# Altium schematic sheet TapDriver-ESP32.schdoc_2022-04-13.schdoc
size 401 x 180 mm
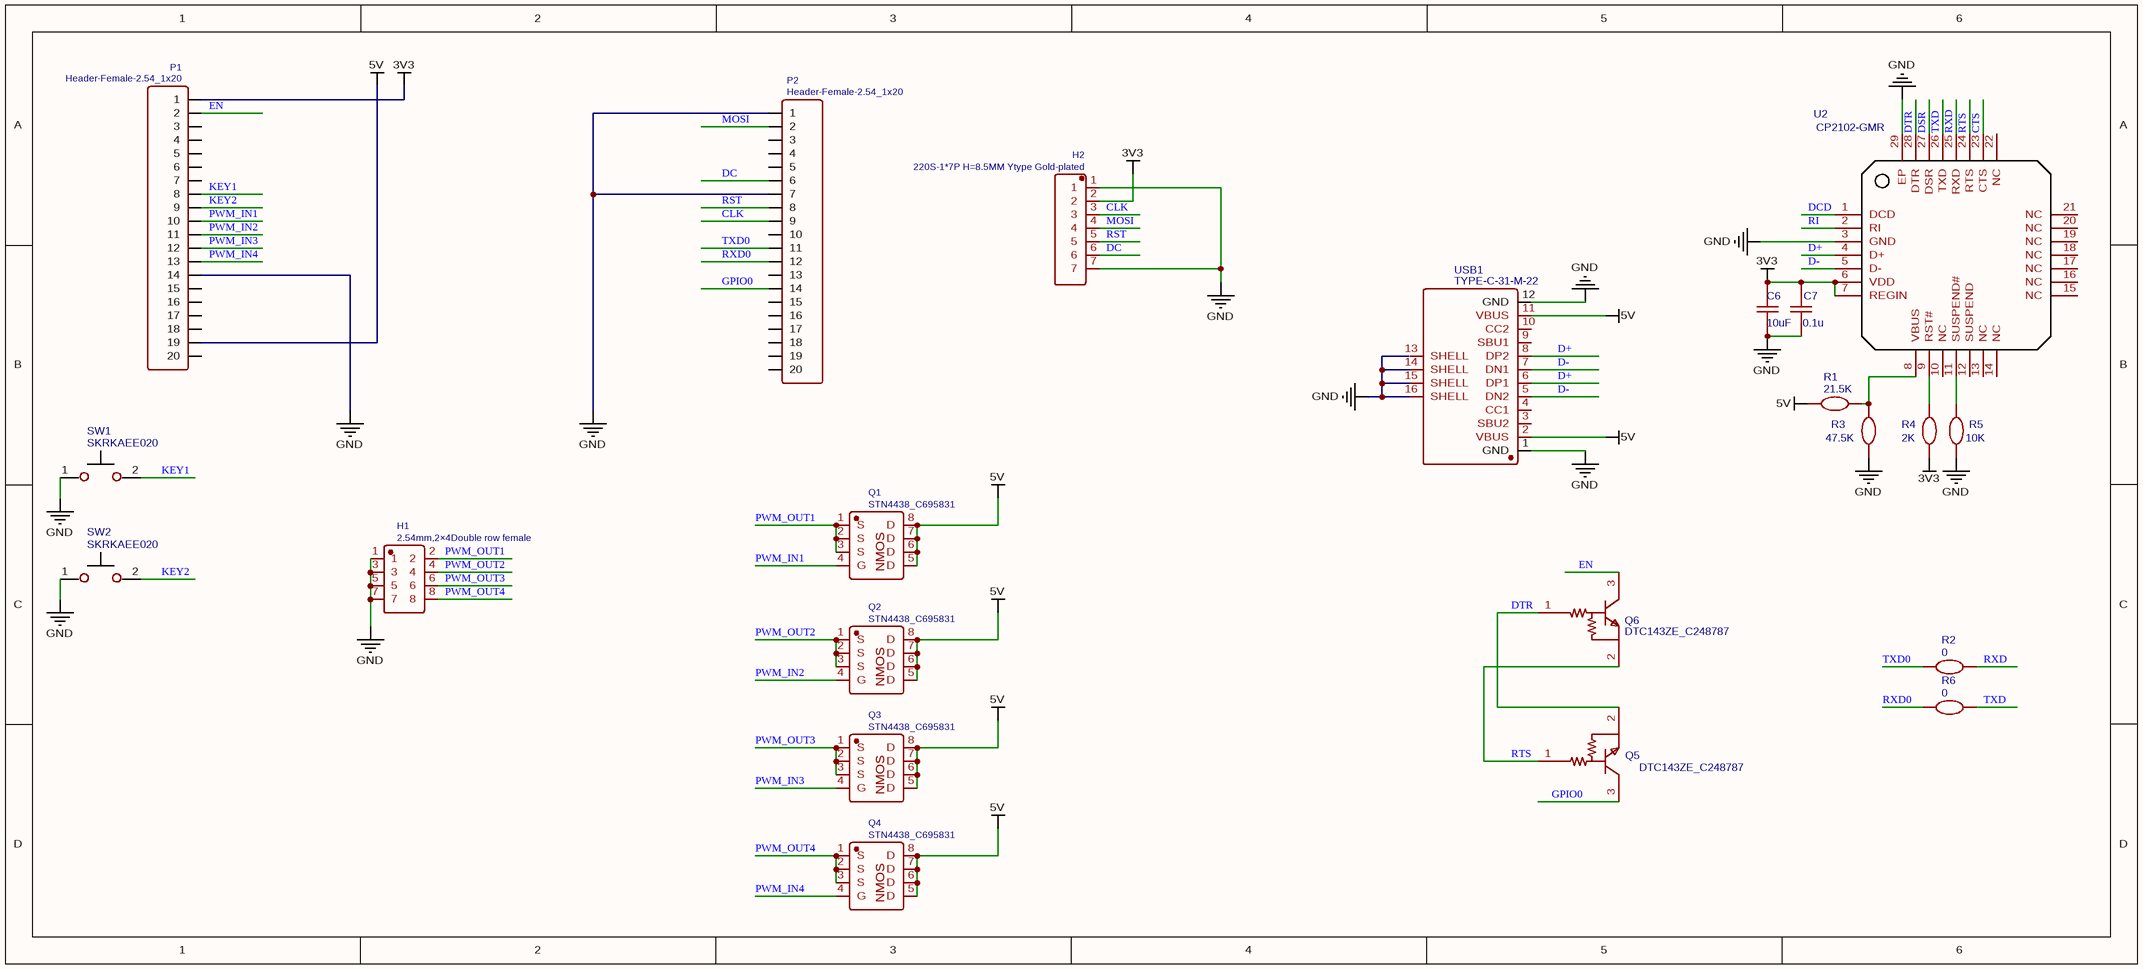
[diagram p0: TapDriver-ESP32.schdoc_2022-04-13.schdoc]

## Parts
C6  10uF  [C0805]
C7  0.1u  [C0603]
H1  2.54mm,2×4Double row female  [HDR-TH_8P-P2.54-V-F-R2-C4-S2.54-1]
H2  220S-1*7P H=8.5MM Ytype Gold-plated  [HDR-TH_7P-P2.54-V-F]
P1  Header-Female-2.54_1x20  [HDR-TH_20P-P2.54-V-F]
P2  Header-Female-2.54_1x20  [HDR-TH_20P-P2.54-V-F]
Q1  STN4438_C695831  [SOP-8_L4.9-W3.9-P1.27-LS6.0-BL]
Q2  STN4438_C695831  [SOP-8_L4.9-W3.9-P1.27-LS6.0-BL]
Q3  STN4438_C695831  [SOP-8_L4.9-W3.9-P1.27-LS6.0-BL]
Q4  STN4438_C695831  [SOP-8_L4.9-W3.9-P1.27-LS6.0-BL]
Q5  DTC143ZE_C248787  [SOT-523-3_L1.6-W0.8-P1.00-LS1.6-BR]
Q6  DTC143ZE_C248787  [SOT-523-3_L1.6-W0.8-P1.00-LS1.6-BR]
R1  21.5K  [R0603]
R2  0  [R0603]
R3  47.5K  [R0603]
R4  2K  [R0603]
R5  10K  [R0603]
R6  0  [R0603]
SW1  SKRKAEE020  [SKRKAEE020]
SW2  SKRKAEE020  [SKRKAEE020]
U2  CP2102-GMR  [QFN-28_L5.0-W5.0-P0.50-BL-EP]
USB1  TYPE-C-31-M-22  [USB-C-SMD_TYPE-C-31-M-22]

## Nets
3V3: C6.2 C7.2 H2.2 P1.1 R4.1 U2.6(VDD) U2.7(REGIN)
5V: P1.19 Q1.5(D) Q1.6(D) Q1.7(D) Q1.8(D) Q2.5(D) Q2.6(D) Q2.7(D) Q2.8(D) Q3.5(D) Q3.6(D) Q3.7(D) Q3.8(D) Q4.5(D) Q4.6(D) Q4.7(D) Q4.8(D) R1.2 USB1.2(VBUS) USB1.11(VBUS)
GND: C6.1 C7.1 H1.1 H1.3 H1.5 H1.7 H2.1 H2.7 P1.14 P2.1 P2.7 R3.1 R5.1 SW1.1 SW2.1 U2.3(GND) U2.29(EP) USB1.1(GND) USB1.12(GND) USB1.14(SHELL) USB1.15(SHELL) USB1.16(SHELL)
CLK: H2.3 P2.9
CTS: U2.23(CTS)
D+: U2.4(D+) USB1.6(DP1) USB1.8(DP2)
D-: U2.5(D-) USB1.5(DN2) USB1.7(DN1)
DC: H2.6 P2.6
DCD: U2.1(DCD)
DSR: U2.27(DSR)
DTR: Q5.2(E) Q6.1(B) U2.28(DTR)
EN: P1.2 Q6.3(C)
GPIO0: P2.14 Q5.3(C)
KEY1: P1.8 SW1.2
KEY2: P1.9 SW2.2
MOSI: H2.4 P2.2
PWM_IN1: P1.10 Q1.4(G)
PWM_IN2: P1.11 Q2.4(G)
PWM_IN3: P1.12 Q3.4(G)
PWM_IN4: P1.13 Q4.4(G)
PWM_OUT1: H1.2 Q1.1(S) Q1.2(S) Q1.3(S)
PWM_OUT2: H1.4 Q2.1(S) Q2.2(S) Q2.3(S)
PWM_OUT3: H1.6 Q3.1(S) Q3.2(S) Q3.3(S)
PWM_OUT4: H1.8 Q4.1(S) Q4.2(S) Q4.3(S)
RI: U2.2(RI)
RST: H2.5 P2.8
RTS: Q5.1(B) Q6.2(E) U2.24(RTS)
RXD: R2.1 U2.25(RXD)
RXD0: P2.12 R6.2
TXD: R6.1 U2.26(TXD)
TXD0: P2.11 R2.2
NetR1_1: R1.1 R3.2 U2.8(VBUS)
NetR4_2: R4.2 U2.9(RST#)
NetR5_2: R5.2 U2.11(SUSPEND#)

Not connected (* = marked no-connect by the designer): P1 3 4 5 6 7 15 16 17 18 20; P2 3 4 5 10 13 15 16 17 18 19 20; U2 10(NC) 12(SUSPEND) 13(NC) 14(NC) 15(NC) 16(NC) 17(NC) 18(NC) 19(NC) 20(NC) 21(NC) 22(NC); USB1 3(SBU2) 4(CC1) 9(SBU1) 10(CC2) 13(SHELL)

## Notes on the sheet
- (in symbol STN4438_C695831) NMOS

## Library data of the parts
C6 = 10uF: nameAlias: Value(F); Contributor: LCEDA_Lib; spicePre: C; spiceSymbolName: C_0805_US
C7 = 0.1u: nameAlias: Value(F); Contributor: LCEDA_Lib; spicePre: C; spiceSymbolName: C_0603_US
H1 = 2.54mm,2×4Double row female: BOM_Manufacturer: ReliaPro; BOM_Supplier Part: C58378; BOM_Supplier: LCSC; BOM_Manufacturer Part: 2.54mm,2×4Double row female; spicePre: H; spiceSymbolName: 2.54mm,2×4Double row female
H2 = 220S-1*7P H=8.5MM Ytype Gold-plated: BOM_Manufacturer: Ckmtw; Contributor: LCSC; BOM_Supplier: LCSC; BOM_Manufacturer Part: 220S-1*7P H=8.5MM Ytype Gold-plated; BOM_Supplier Part: C124418; BOM_JLCPCB Part Class: Extended Part; spicePre: H; spiceSymbolName: 220S-1*7P H=8.5MM Ytype Gold-plated
P1 P2 = Header-Female-2.54_1x20: BOM_Manufacturer: BOOMELE; BOM_Manufacturer Part: 2.54mm 1*20P Female header; BOM_Supplier: LCSC; BOM_Supplier Part: C50984; BOM_JLCPCB Part Class: Extended Part; spicePre: P; spiceSymbolName: Header-Female-2.54_1x20
Q1-Q4 = STN4438_C695831: BOM_Manufacturer: UMW(友台半导体); Contributor: LCSC; BOM_Supplier: LCSC; BOM_Supplier Part: C695831; BOM_Manufacturer Part: STN4438; BOM_JLCPCB Part Class: Extended Part; spicePre: Q; spiceSymbolName: STN4438_C695831
Q5 Q6 = DTC143ZE_C248787: BOM_Manufacturer: Tak Cheong; Contributor: LCSC; BOM_Supplier: LCSC; BOM_Supplier Part: C248787; BOM_Manufacturer Part: DTC143ZE; BOM_JLCPCB Part Class: Extended Part; spicePre: Q; spiceSymbolName: DTC143ZE_C248787
R1 = 21.5K: nameAlias: Value(Ω); Contributor: LCEDA_Lib; spicePre: R; spiceSymbolName: R_1206_EU
R2 R6 = 0: nameAlias: Value(Ω); Contributor: LCEDA_Lib; spicePre: R; spiceSymbolName: R_1206_EU
R3 = 47.5K: nameAlias: Value(Ω); Contributor: LCEDA_Lib; spicePre: R; spiceSymbolName: R_1206_EU
R4 = 2K: nameAlias: Value(Ω); Contributor: LCEDA_Lib; spicePre: R; spiceSymbolName: R_1206_EU
R5 = 10K: nameAlias: Value(Ω); Contributor: LCEDA_Lib; spicePre: R; spiceSymbolName: R_1206_EU
SW1 SW2 = SKRKAEE020: BOM_Manufacturer: ALPS; BOM_Supplier: LCSC; BOM_Manufacturer Part: SKRKAEE020; BOM_Supplier Part: C115357; spicePre: S
U2 = CP2102-GMR: BOM_Manufacturer: SILICON LABS; BOM_Supplier: LCSC; BOM_Manufacturer Part: CP2102-GMR; BOM_Supplier Part: C6568; BOM_JLCPCB Part Class: Basic Part; spicePre: U; spiceSymbolName: CP2102-GMR
USB1 = TYPE-C-31-M-22: BOM_Manufacturer: 韩国韩荣; Contributor: LCSC; BOM_Supplier: LCSC; BOM_Supplier Part: C530612; BOM_Manufacturer Part: TYPE-C-31-M-22; spicePre: U; spiceSymbolName: TYPE-C-31-M-22